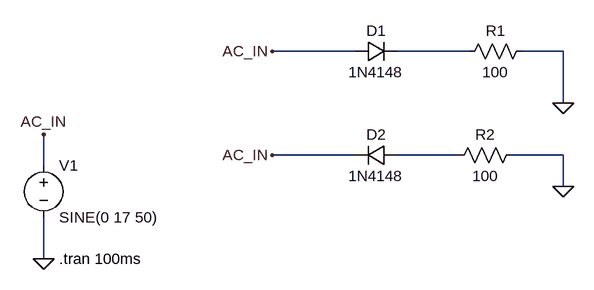
[diagram p0: schematic Diodos.asc]
Diodos.asc, the LTspice schematic file:
Version 4
SHEET 1 1056 680
WIRE 528 -32 400 -32
WIRE 704 -32 592 -32
WIRE 848 -32 784 -32
WIRE 848 48 848 -32
WIRE 528 128 400 128
WIRE 688 128 592 128
WIRE 848 128 768 128
WIRE 48 144 48 96
WIRE 848 176 848 128
WIRE 48 288 48 224
FLAG 48 96 AC_IN
FLAG 48 288 0
FLAG 400 -32 AC_IN
FLAG 848 48 0
FLAG 400 128 AC_IN
FLAG 848 176 0
SYMBOL voltage 48 128 R0
WINDOW 123 0 0 Left 0
WINDOW 39 0 0 Left 0
SYMATTR InstName V1
SYMATTR Value SINE(0 17 50)
SYMBOL diode 528 -16 R270
WINDOW 0 32 32 VTop 2
WINDOW 3 0 32 VBottom 2
SYMATTR InstName D1
SYMATTR Value 1N4148
SYMBOL res 800 -48 R90
WINDOW 0 0 56 VBottom 2
WINDOW 3 32 56 VTop 2
SYMATTR InstName R1
SYMATTR Value 100
SYMATTR SpiceLine tol=1 pwr=0.1
SYMBOL diode 592 112 R90
WINDOW 0 0 32 VBottom 2
WINDOW 3 32 32 VTop 2
SYMATTR InstName D2
SYMATTR Value 1N4148
SYMBOL res 784 112 R90
WINDOW 0 0 56 VBottom 2
WINDOW 3 32 56 VTop 2
SYMATTR InstName R2
SYMATTR Value 100
SYMATTR SpiceLine tol=1 pwr=0.1
TEXT 72 288 Left 2 !.tran 100ms

The netlist it stands for:
* Diodos.asc
V1 AC_IN 0 SINE(0 17 50)
D1 AC_IN N001 1N4148
R1 0 N001 100 tol=1 pwr=0.1
D2 N002 AC_IN 1N4148
R2 0 N002 100 tol=1 pwr=0.1
.model D D
.lib standard.dio
.tran 100ms
.backanno
.end